# EAGLE design Door-outer (EAGLE 9.2.0)
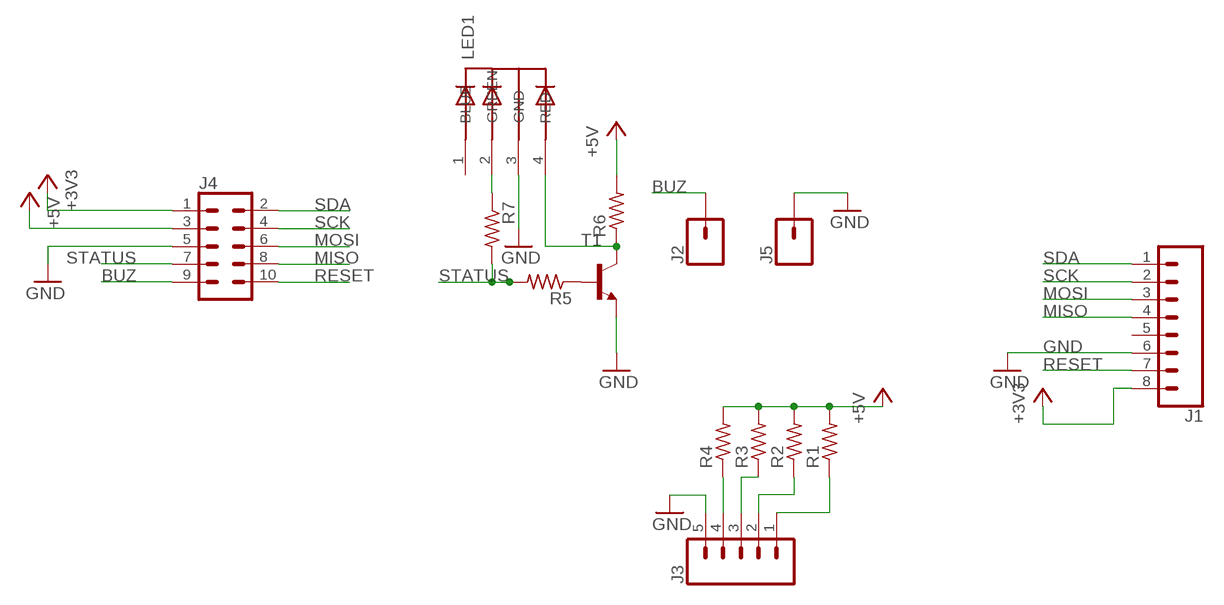
[diagram p0: schematic, sheet 1]

## Parts
J1  CONN_08"  [1X08]
J2  CONN_01PTH_NO_SILK_YES_STOP  [1X01_NO_SILK]
J3  CONN_05  [1X05]
J4  CONN_05X2PTH  [2X5]
J5  CONN_01PTH_NO_SILK_YES_STOP  [1X01_NO_SILK]
LED1  5MMRGBLED  [LED5MMRGB]
R1  R-US_R1206  [R1206]
R2  R-US_R1206  [R1206]
R3  R-US_R1206  [R1206]
R4  R-US_R1206  [R1206]
R5  R-US_R1206  [R1206]
R6  R-US_R1206  [R1206]
R7  R-US_R1206  [R1206]
T1  MPS2222A-NPN-TO92-CBE  [TO92-CBE]

## Nets
+3V3: J1.8 J4.1
+5V: J4.3 R1.2 R2.2 R3.2 R4.2 R6.2
BUZ: J2.1 J4.9
GND: J1.6 J3.5 J4.5 J5.1 LED1.3(GND) T1.E
MISO: J1.4 J4.8
MOSI: J1.3 J4.6
N$1: LED1.2(GREEN) R7.1
N$11: J3.1 R1.1
N$12: J3.2 R2.1
N$13: J3.3 R3.1
N$14: J3.4 R4.1
N$18: LED1.4(RED) R6.1 T1.C
N$20: R5.1 T1.B
RESET: J1.7 J4.10
SCK: J1.2 J4.4
SDA: J1.1 J4.2
STATUS: J4.7 R5.2 R7.2
Unconnected: J1.5 LED1.1(BLUE)

## Library data of the parts
J1 = SparkFun-Connectors:CONN_08: Multi connection point. Often used as Generic Header-pin footprint for 0.1 inch spaced/style header connections On any of the 0.1 inch spaced packages, you can populate with these: Break Away Headers - Straight <https://www.sparkfun.com/products/116> (PRT-00116) Break Away Male Headers - Right Angle <https://www.sparkfun.com/products/553> (PRT-00553) Female Headers <https://www.sparkfun.com/products/115> (PRT-00115) Break Away Headers - Machine Pin <https://www.sparkfun.com/products/117> (PRT-00117) Break Away Female Headers - Swiss Machine Pin <https://www.sparkfun.com/products/743> (PRT-00743) Arduino Stackable Header - 8 Pin <https://www.sparkfun.com/products/9279> (PRT-09279) For SCREWTERMINALS and SPRING TERMINALS visit here: Screw Terimnals on SparkFun.com <https://www.sparkfun.com/search/results?term=Screw+Terminals> (5mm/3.5mm/2.54mm spacing) This device is also useful as a general connection point to wire up your design to another part of your project. Our various solder wires solder well into these plated through hole pads. Hook-Up Wire - Assortment (Stranded, 22 AWG) <https://www.sparkfun.com/products/11375> (PRT-11375) Hook-Up Wire - Assortment (Solid Core, 22 AWG) <https://www.sparkfun.com/products/11367> (PRT-11367) View the entire wire category on our website here <https://www.sparkfun.com/categories/141> Special notes: Molex polarized connector foot print use with SKU : PRT-08231 with associated crimp pins and housings. 1MM SMD Version SKU: PRT-10208 NOTES ON THE VARIANTS LOCK and LOCK_LONGPADS... This footprint was designed to help hold the alignment of a through-hole component (i.e. 6-pin header) while soldering it into place. You may notice that each hole has been shifted either up or down by 0.005 of an inch from it's more standard position (which is a perfectly straight line). This slight alteration caused the pins (the squares in the middle) to touch the edges of the holes. Because they are alternating, it causes a "brace" to hold the component in place. 0.005 has proven to be the perfect amount of "off-center" position when using our standard breakaway headers. Although looks a little odd when you look at the bare footprint, once you have a header in there, the alteration is very hard to notice. Also,if you push a header all the way into place, it is covered up entirely on the bottom side.; PROD_ID: CONN-08438
J2 J5 = SparkFun-Connectors:CONN_01: Single connection point. Often used as Generic Header-pin footprint for 0.1 inch spaced/style header connections On any of the 0.1 inch spaced packages, you can populate with these: Break Away Headers - Straight <https://www.sparkfun.com/products/116> (PRT-00116) Break Away Male Headers - Right Angle <https://www.sparkfun.com/products/553> (PRT-00553) Female Headers <https://www.sparkfun.com/products/115> (PRT-00115) Break Away Headers - Machine Pin <https://www.sparkfun.com/products/117> (PRT-00117) Break Away Female Headers - Swiss Machine Pin <https://www.sparkfun.com/products/743> (PRT-00743) This device is also useful as a general connection point to wire up your design to another part of your project. Our various solder wires solder well into these plated through hole pads. Hook-Up Wire - Assortment (Stranded, 22 AWG) <https://www.sparkfun.com/products/11375> (PRT-11375) Hook-Up Wire - Assortment (Solid Core, 22 AWG) <https://www.sparkfun.com/products/11367> (PRT-11367) View the entire wire category on our website here <https://www.sparkfun.com/categories/141> Special notes: SMTSO-256-ET is a "flush mount" nut for a 4-40 screw. We mostly use this on specialty testbeds; it is a nice way to connect hardware to your PCB at an adjustable hieght. Also note, the SNAP packages are for using a snappable style connector. We sell a baggie of snaps and they are also used on two LilyPad designs: Snap Assortment - 30 pack (male and female) <https://www.sparkfun.com/products/11347> (DEV-11347) LilyPad Arduino SimpleSnap <https://www.sparkfun.com/products/10941> (DEV-10941) LilyPad SimpleSnap Protoboard <https://www.sparkfun.com/products/10940> (DEV-10940)
J3 = SparkFun-Connectors:CONN_05: Multi connection point. Often used as Generic Header-pin footprint for 0.1 inch spaced/style header connections On any of the 0.1 inch spaced packages, you can populate with these: Break Away Headers - Straight <https://www.sparkfun.com/products/116> (PRT-00116) Break Away Male Headers - Right Angle <https://www.sparkfun.com/products/553> (PRT-00553) Female Headers <https://www.sparkfun.com/products/115> (PRT-00115) Break Away Headers - Machine Pin <https://www.sparkfun.com/products/117> (PRT-00117) Break Away Female Headers - Swiss Machine Pin <https://www.sparkfun.com/products/743> (PRT-00743) For SCREWTERMINALS and SPRING TERMINALS visit here: Screw Terimnals on SparkFun.com <https://www.sparkfun.com/search/results?term=Screw+Terminals> (5mm/3.5mm/2.54mm spacing) This device is also useful as a general connection point to wire up your design to another part of your project. Our various solder wires solder well into these plated through hole pads. Hook-Up Wire - Assortment (Stranded, 22 AWG) <https://www.sparkfun.com/products/11375> (PRT-11375) Hook-Up Wire - Assortment (Solid Core, 22 AWG) <https://www.sparkfun.com/products/11367> (PRT-11367) View the entire wire category on our website here <https://www.sparkfun.com/categories/141> Special notes: Molex polarized connector foot print use with SKU : PRT-08231 with associated crimp pins and housings. 1MM SMD Version SKU: PRT-10208
J4 = SparkFun-Connectors:CONN_05X2: Multi connection point. Often used as Generic Header-pin footprint for 0.1 inch spaced/style header connections For AVR SPI programming port, see special device with nice symbol: "AVR_SPI_PROG_5x2.dev" You can populate with any combo of single row headers, but if you'd like an exact match, check these: 2x5 AVR ICSP Male Header <https://www.sparkfun.com/products/778> (PRT-00778) 2x5 Pin Shrouded Header <https://www.sparkfun.com/products/8506> (PRT-08506) On any of the 0.1 inch spaced packages, you can populate with these: Break Away Headers - Straight <https://www.sparkfun.com/products/116> (PRT-00116) Break Away Male Headers - Right Angle <https://www.sparkfun.com/products/553> (PRT-00553) Female Headers <https://www.sparkfun.com/products/115> (PRT-00115) Break Away Headers - Machine Pin <https://www.sparkfun.com/products/117> (PRT-00117) Break Away Female Headers - Swiss Machine Pin <https://www.sparkfun.com/products/743> (PRT-00743) Special note: the shrouded connector mates well with our 5x2 ribbon cables: 2x5 Pin IDC Ribbon Cable <https://www.sparkfun.com/products/8535> (PRT-08535); PROD_ID: CONN-08499; SF_ID: PRT-0778
LED1 = adafruit:5MMRGBLED
R1-R7 = resistor:R-US_: RESISTOR, American symbol
T1 = transistor:*-NPN-: NPN Transistror BF959 corrected 2008.03.06

## Board
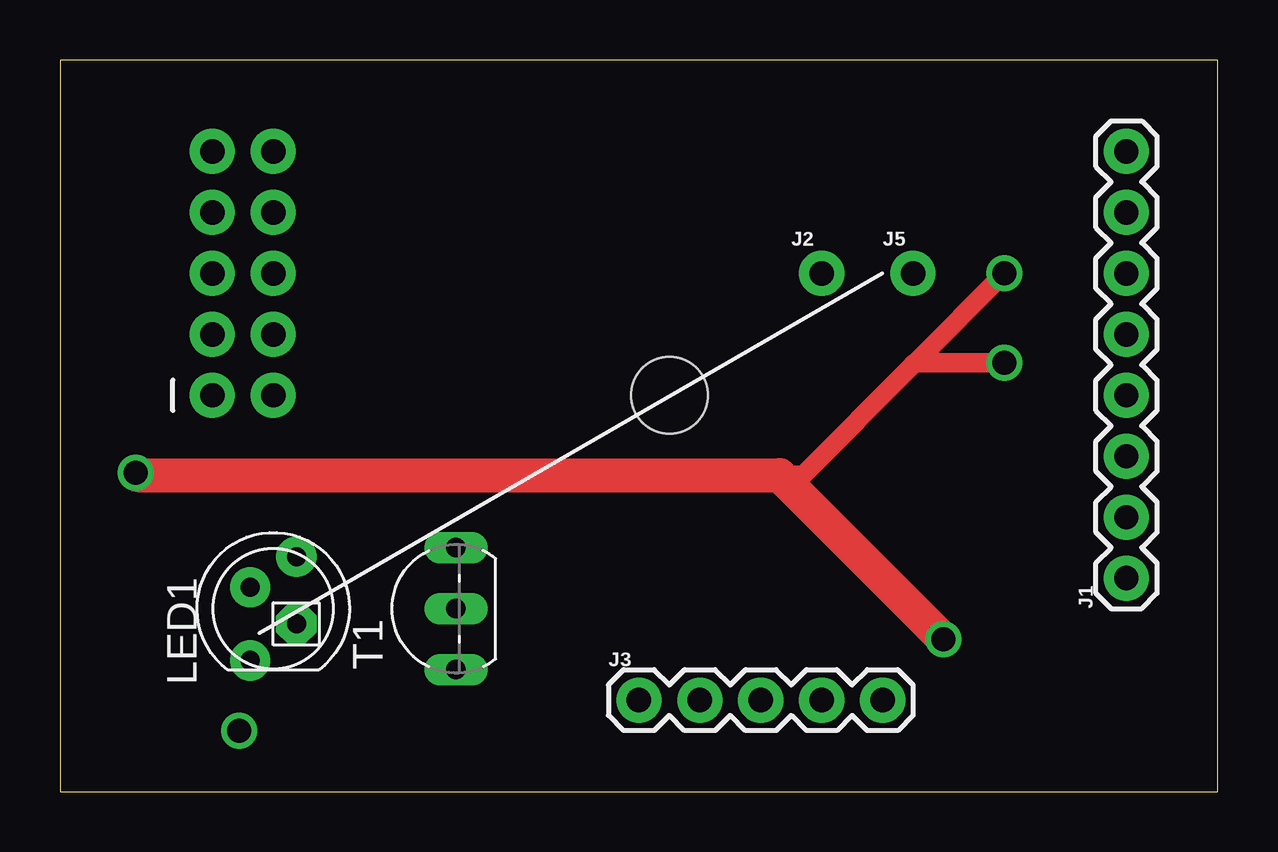
[diagram p1: board, top side]
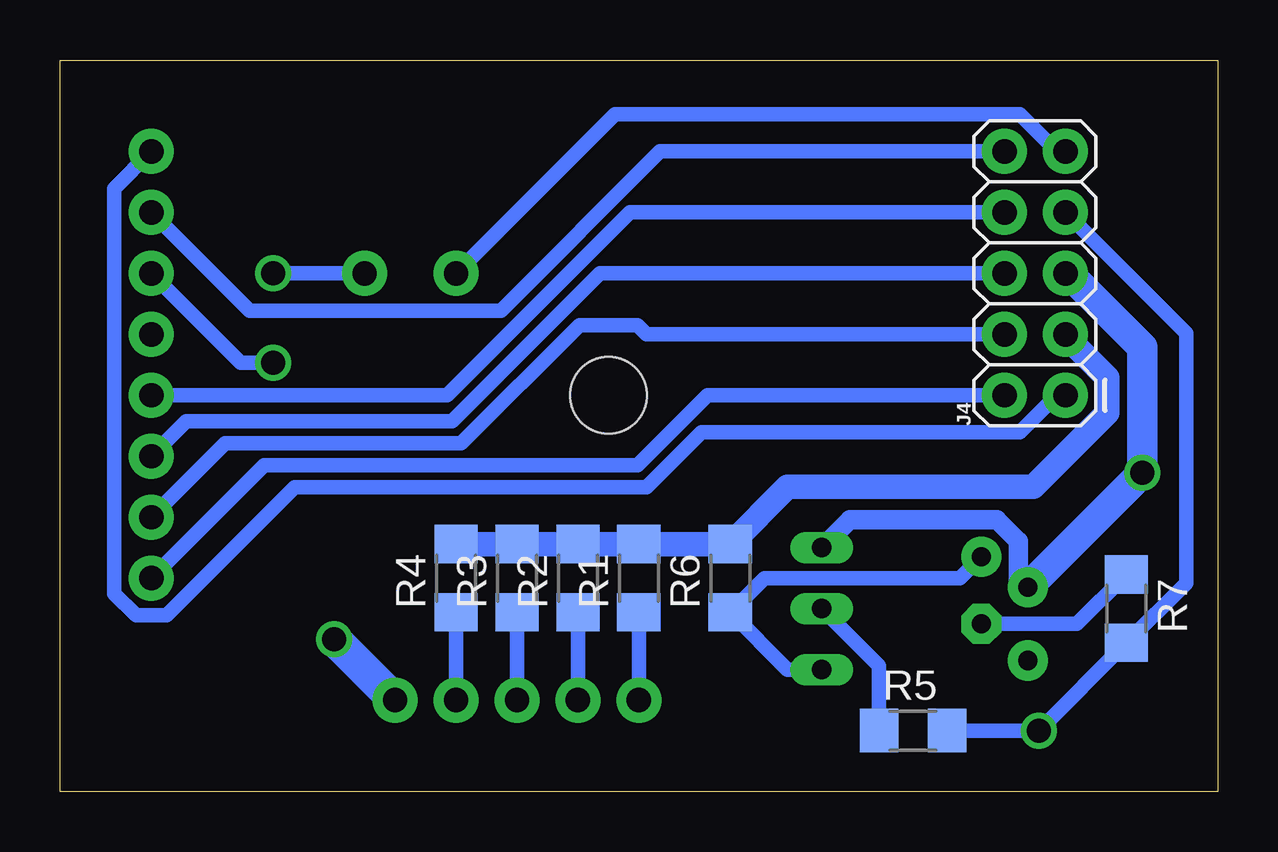
[diagram p2: board, bottom side, seen from below]

Size 48.26 x 30.48 mm. Coordinates in mm from the lower left corner, seen from the top.
Outline: 0,0 48.26,0 48.26,30.48 0,30.48 0,0
Copper layers (1*16): Top 0.035mm / dielectric 1.5mm / Bottom 0.035mm
Design rules "default *": minimum track width 10mil, minimum drill 0.6mm, track to track 12mil, track to pad 12mil, pad to pad 12mil, via to via 12mil, smd to smd 12mil, copper to edge 40mil, drill to drill 6mil, minimum pad ring 10mil, minimum via ring 8mil, stop-mask expansion 4mil, vias tented up to drill 0mil, thermal gap 10mil
Holes 3.2 mm at 25.4,16.51

### Footprints (pad centres in the part's own frame; a part is rotated, then mirrored left to right if it is on the bottom)
1X08 = drill 1.016 pad 1.88: 1 0,0; 2 2.54,0; 3 5.08,0; 4 7.62,0; 5 10.16,0; 6 12.7,0; 7 15.24,0; 8 17.78,0
1X01_NO_SILK = drill 1.016 pad 1.88: 1 0,0
1X05 = drill 1.016 pad 1.88: 1 0,0; 2 2.54,0; 3 5.08,0; 4 7.62,0; 5 10.16,0
2X5 = drill 1.016 pad 1.88: 1 0,0; 2 0,2.54; 3 2.54,0; 4 2.54,2.54; 5 5.08,0; 6 5.08,2.54; 7 7.62,0; 8 7.62,2.54; 9 10.16,0; 10 10.16,2.54
LED5MMRGB = drill 0.8 pad 1.676: 1 -2.159,0.968; 3 0.889,0.968; 4 2.159,-0.968 | drill 0.8 pad 1.676 octagon: 2 -0.635,-0.968
R1206 = smd 1.6 x 1.803: 1 -1.422,0; 2 1.422,0
TO92-CBE = drill 0.813 long: B 0,0; C -2.54,0; E 2.54,0

### Placement (x,y rotation side)
J1  44.45,8.89 90 top
J2  31.75,21.59 0 top
J3  24.13,3.81 0 top
J4  6.35,16.51 90 bottom
J5  35.56,21.59 0 top
LED1  8.89,7.62 90 top
R1  24.13,8.89 90 bottom
R2  26.67,8.89 90 bottom
R3  29.21,8.89 90 bottom
R4  31.75,8.89 90 bottom
R5  12.7,2.54 0 bottom
R6  20.32,8.89 90 bottom
R7  3.81,7.62 270 bottom
T1  16.51,7.62 90 top

### Tracks (layer width: path | path; a pad name or v marks a point on that pad's centre or on a via)
+3V3
  Bottom 0.61: J4.1 6.7,16.51 8.25,14.96 21.53,14.96 23.81,12.68 38.47,12.68 43.81,7.34 45.09,7.34 46,8.25 46,25.12 J1.8
+5V
  Bottom 1.016: J4.3 6.35,18.99 4.6,17.24 4.6,15.78 7.68,12.7 17.93,12.7 R6.2 R1.2 R2.2 R3.2 R4.2
BUZ
  Bottom 0.61: J4.9 6.7,26.67 8.25,28.22 25.12,28.22 J2.1
GND  (via drill 1 pad 0.6)
  Top 0.813: 30,13.18 30.96,13.18 35.56,17.78 35.65,17.87 | v39.37,21.59 35.65,17.87 | 35.65,17.87 v39.37,17.87
  Top 1.422: v3.15,13.28 3.25,13.18 30,13.18 v36.83,6.35
  Bottom 0.61: v39.37,21.59 J5.1 | v39.37,17.87 40.73,17.87 J1.6
  Bottom 0.813: LED1.3 8.31,8.9 8.31,10.42 9.22,11.33 15.34,11.33 T1.E
  Bottom 1.27: J4.5 6.23,21.59 3.15,18.51 v3.15,13.28 LED1.3
  Bottom 1.422: J3.5 v36.83,6.35
MISO
  Bottom 0.61: J1.4 32.12,16.51 24.5,24.13 J4.8
MOSI
  Bottom 0.61: J4.6 25.74,21.59 31.92,15.42 43,15.42 J1.3
N$1
  Bottom 0.61: R7.1 5.87,6.99 LED1.2
N$11
  Bottom 0.61: R1.1 J3.1
N$12
  Bottom 0.61: R2.1 J3.2
N$13
  Bottom 0.61: R3.1 J3.3
N$14
  Bottom 0.61: R4.1 J3.4
N$18
  Bottom 0.61: T1.C 17.93,5.08 R6.1 18.9,8.89 10.75,8.89 LED1.4
N$20
  Bottom 0.61: R5.1 14.12,5.23 T1.B
RESET
  Bottom 0.61: J4.10 23.25,26.67 29.88,20.04 40.36,20.04 J1.7
SCK
  Bottom 0.61: J1.2 41.38,14.5 31.54,14.5 26.61,19.43 24.19,19.43 23.81,19.05 J4.4
SDA
  Bottom 0.61: J4.2 21.27,16.51 24.19,13.59 39.75,13.59 J1.1
STATUS  (via drill 1)
  Bottom 0.61: J4.7 1.32,19.1 1.32,8.69 R7.2 v7.47,2.54 R5.2